# Altium schematic sheet board.SchDoc
size A4; SheetNumber: 2; SheetTotal: 7
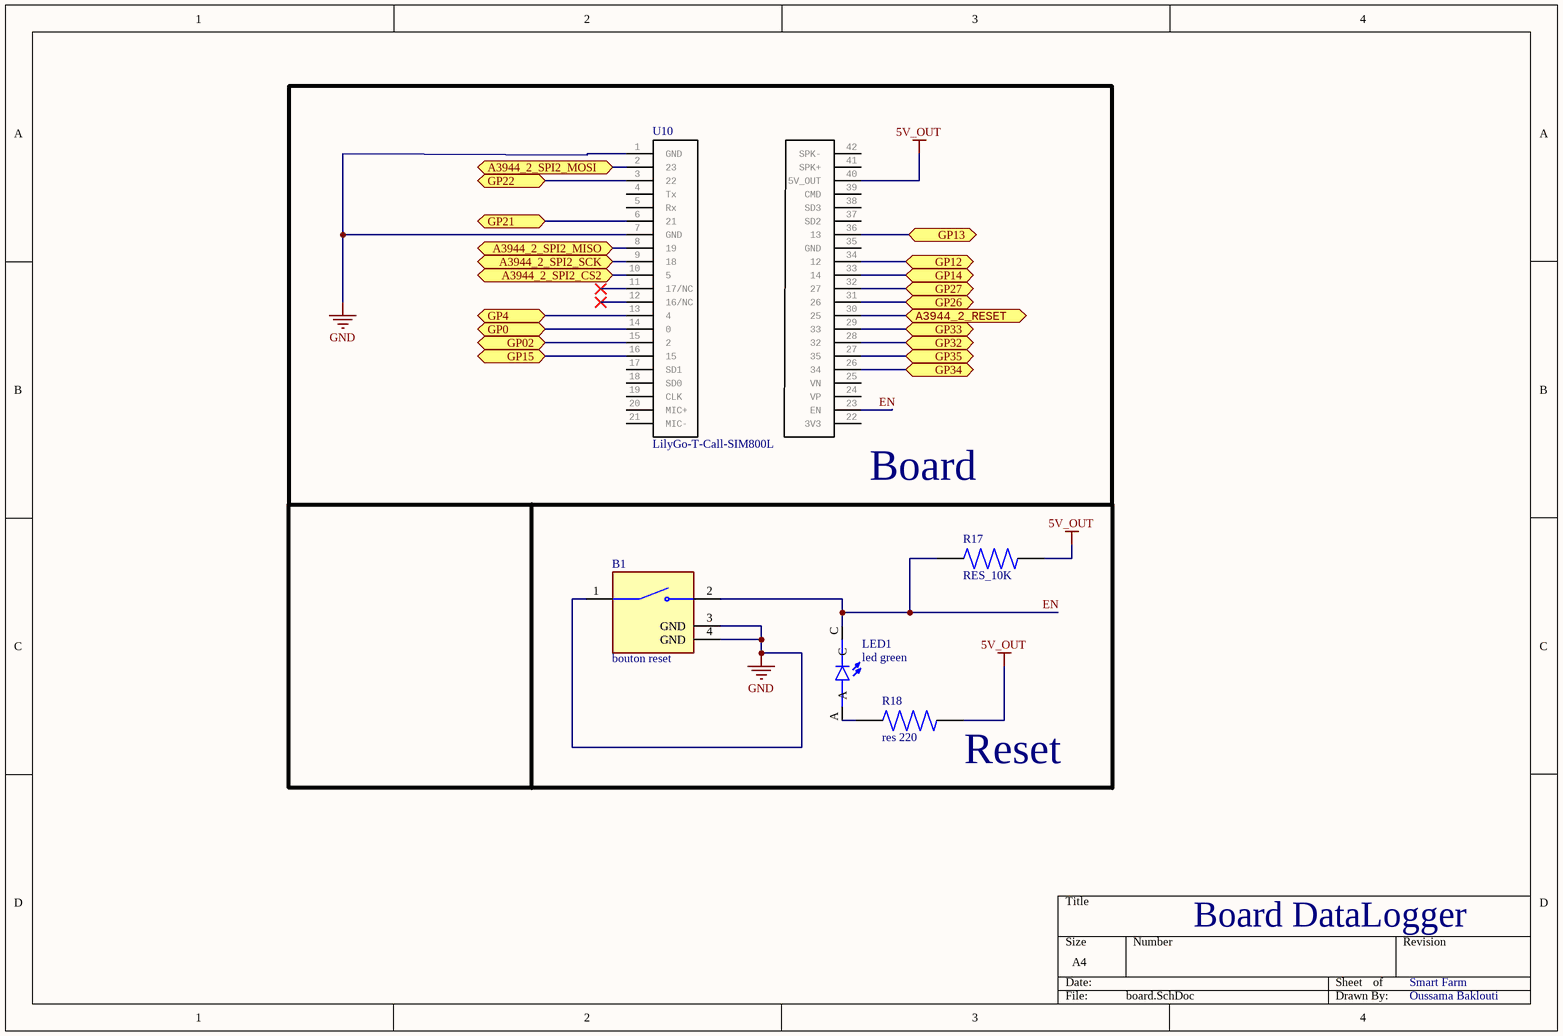
[diagram p0: board.SchDoc]

## Parts
B1  bouton reset  [button]
LED1  led green  [led green]
R17  RES_10K  [RES_10k]
R18  res 220  [res 220]
U10  LilyGo-T-Call-SIM800L  [LilyGo-T-Call-SIM800L]

## Blocks framed on the sheet
Board: U10

## Ports
A3944_2_RESET (bidir), A3944_2_SPI2_CS2 (bidir), A3944_2_SPI2_MISO (bidir), A3944_2_SPI2_MOSI (bidir), A3944_2_SPI2_SCK (bidir), GP0 (bidir), GP02 (bidir), GP4 (bidir), GP12 (bidir), GP13 (bidir), GP14 (bidir), GP15 (bidir), GP21 (bidir), GP22 (bidir), GP26 (bidir), GP27 (bidir), GP32 (bidir), GP33 (bidir), GP34 (bidir), GP35 (bidir)

## Nets
5V_OUT: R17.2 R18.2 U10.40(5V_OUT)
GND: B1.1(COM) B1.3(GND) B1.4(GND) U10.1(GND) U10.7(GND)
A3944_2_RESET: U10.30(25) ; port A3944_2_RESET
A3944_2_SPI2_CS2: U10.10(5) ; port A3944_2_SPI2_CS2
A3944_2_SPI2_MISO: U10.8(19) ; port A3944_2_SPI2_MISO
A3944_2_SPI2_MOSI: U10.2(23) ; port A3944_2_SPI2_MOSI
A3944_2_SPI2_SCK: U10.9(18) ; port A3944_2_SPI2_SCK
EN: B1.2(NO) LED1.C R17.1 U10.23(EN)
GP0: U10.14(0) ; port GP0
GP02: U10.15(2) ; port GP02
GP4: U10.13(4) ; port GP4
GP12: U10.34(12) ; port GP12
GP13: U10.36(13) ; port GP13
GP14: U10.33(14) ; port GP14
GP15: U10.16(15) ; port GP15
GP21: U10.6(21) ; port GP21
GP22: U10.3(22) ; port GP22
GP26: U10.31(26) ; port GP26
GP27: U10.32(27) ; port GP27
GP32: U10.28(32) ; port GP32
GP33: U10.29(33) ; port GP33
GP34: U10.26(34) ; port GP34
GP35: U10.27(35) ; port GP35
NetLED1_A: LED1.A R18.1

Not connected (* = marked no-connect by the designer): U10 4(Tx) 5(Rx) 11(17/NC)* 12(16/NC)* 17(SD1) 18(SD0) 19(CLK) 20(MIC+) 21(MIC-) 22(3V3) 24(VP) 25(VN) 35(GND) 37(SD2) 38(SD3) 39(CMD) 41(SPK+) 42(SPK-)

## Notes on the sheet
- (near R18) Reset
- Board DataLogger
- Smart Farm
- Oussama Baklouti

## Library data of the parts
B1 = bouton reset: Mfr: CUI Devices; Mfr réf: TS11-674-120-BK-260-RA-D; Supplier: DigiKey; Supplier réf: 2223-TS11-674-120-BK-260-RA-D-ND
LED1 = led green: Mfr: Lumex Opto/Components Inc.; Mfr réf: SSF-LXH305GD-TR; Supplier: DigiKey; Supplier réf: 67-1375-6-ND
R17 = RES_10K: Thick Film Resistors - SMD ResHighPowerA 0805 10k 1% 1/2W TC100; Mfr: Bourns Inc.; Mfr réf: CMP0805AFX-1002ELF; Supplier: Mouser; Supplier réf: 652-CMP0805AFX-1002L; Footprint: R0805
R18 = res 220: Thick Film Resistors - SMD 1/2watt 220ohms 1% High Power AEC-Q200; Mfr: Vishay Dale; Mfr Réf: CRCW0805220RFKEAHP; Supplier: Mouser; Supplier réf: 71-CRCW0805220RFKEAH; Footprint: R0805
U10 = LilyGo-T-Call-SIM800L: ESP32 Wireless Module GPRS Antenna SIM Card SIM800L Module